# Altium schematic sheet PWM_inverter.SchDoc
size A4
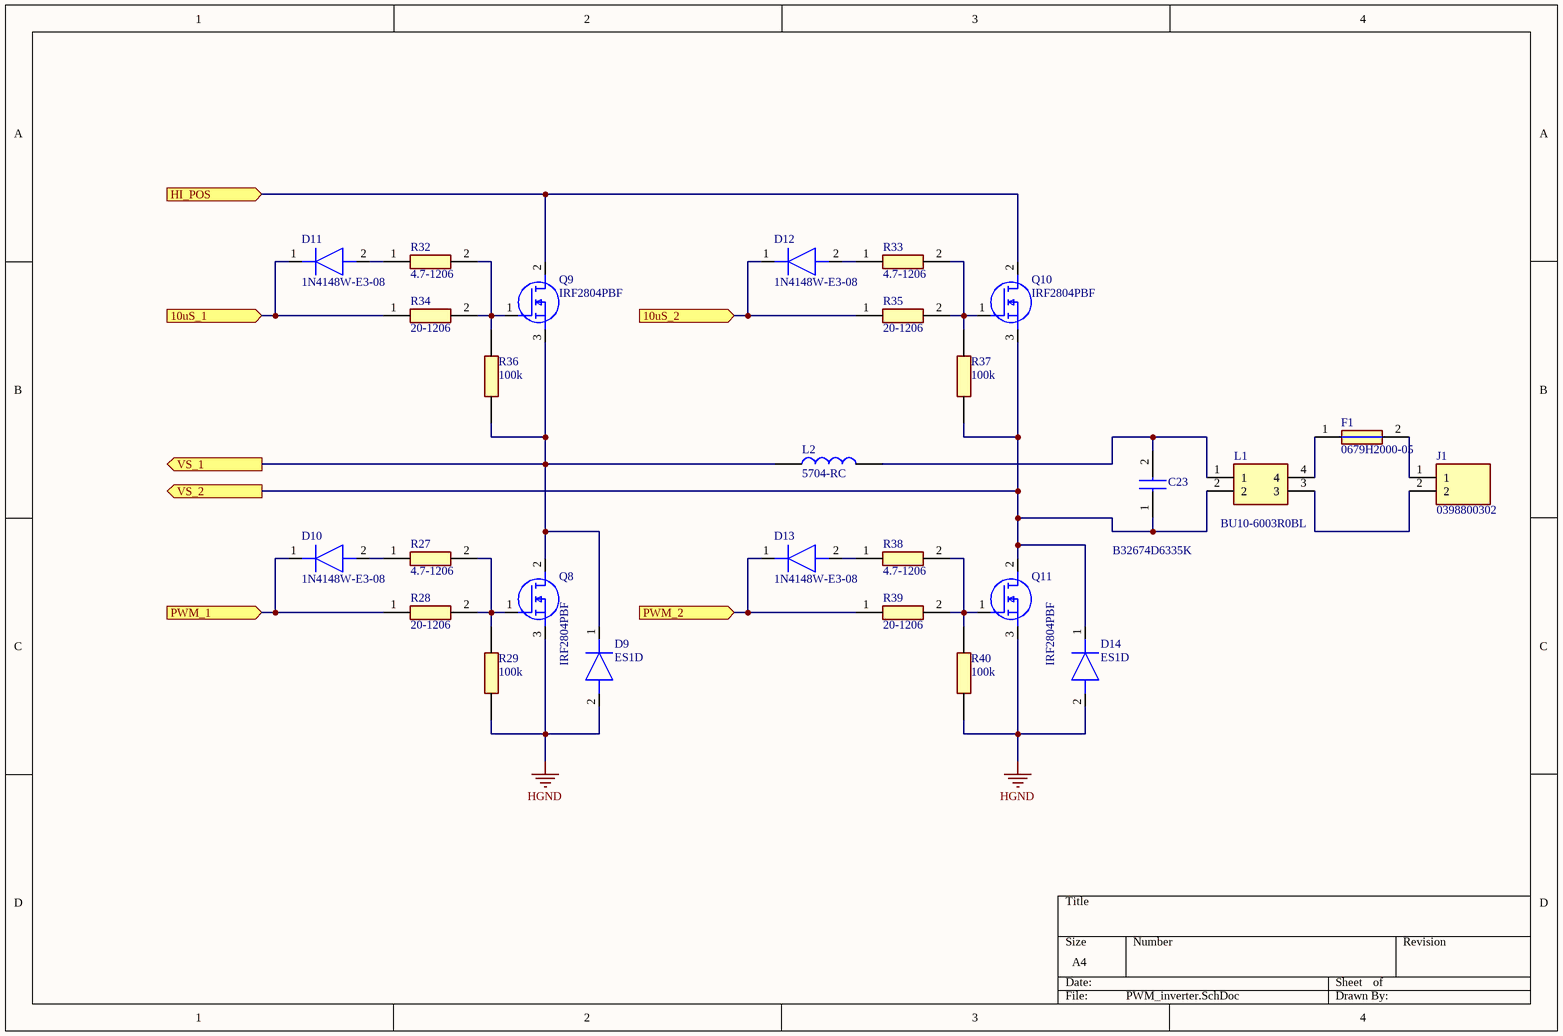
[diagram p0: PWM_inverter.SchDoc]

## Parts
C23  B32674D6335K  [B32674D6335K]
D9  ES1D  [DIOM5226X295N]
D10  1N4148W-E3-08  [SOD3716X135N]
D11  1N4148W-E3-08  [SOD3716X135N]
D12  1N4148W-E3-08  [SOD3716X135N]
D13  1N4148W-E3-08  [SOD3716X135N]
D14  ES1D  [DIOM5226X295N]
F1  0679H2000-05  [FUSC6125X279N]
J1  0398800302  [0398800302]
L1  BU10-6003R0BL  [BU106003R0BL]
L2  5704-RC  [5704RC]
Q8  IRF2804PBF  [TO254P482X1016X2192-3P]
Q9  IRF2804PBF  [TO254P482X1016X2192-3P]
Q10  IRF2804PBF  [TO254P482X1016X2192-3P]
Q11  IRF2804PBF  [TO254P482X1016X2192-3P]
R27  4.7-1206  [RESC3116X75N]
R28  20-1206  [RESC3116X75N]
R29  100k  [RESC2013X65N]
R32  4.7-1206  [RESC3116X75N]
R33  4.7-1206  [RESC3116X75N]
R34  20-1206  [RESC3116X75N]
R35  20-1206  [RESC3116X75N]
R36  100k  [RESC2013X65N]
R37  100k  [RESC2013X65N]
R38  4.7-1206  [RESC3116X75N]
R39  20-1206  [RESC3116X75N]
R40  100k  [RESC2013X65N]

## Ports
10uS_1 (in), 10uS_2 (in), HI_POS (in), PWM_1 (in), PWM_2 (in), VS_1 (out), VS_2 (out)

## Nets
HGND: D9.2(A) D14.2(A) Q8.3(S) Q11.3(S) R29.1 R40.1
10uS_1: D11.1(K) R34.1 ; port 10uS_1
10uS_2: D12.1(K) R35.1 ; port 10uS_2
HI_POS: Q9.2(D) Q10.2(D) ; port HI_POS
PWM_1: D10.1(K) R28.1 ; port PWM_1
PWM_2: D13.1(K) R39.1 ; port PWM_2
VS_1: D9.1(K) L2.1 Q8.2(D) Q9.3(S) R36.1 ; port VS_1
VS_2: C23.1 D14.1(K) L1.2 Q10.3(S) Q11.2(D) R37.1 ; port VS_2
NetC23_2: C23.2 L1.1 L2.2
NetD10_2: D10.2(A) R27.1
NetD11_2: D11.2(A) R32.1
NetD12_2: D12.2(A) R33.1
NetD13_2: D13.2(A) R38.1
NetF1_1: F1.1 L1.4
NetF1_2: F1.2 J1.1
NetJ1_2: J1.2 L1.3
NetQ8_1: Q8.1(G) R27.2 R28.2 R29.2
NetQ9_1: Q9.1(G) R32.2 R34.2 R36.2
NetQ10_1: Q10.1(G) R33.2 R35.2 R37.2
NetQ11_1: Q11.1(G) R38.2 R39.2 R40.2

## Library data of the parts
C23 = B32674D6335K: Capacitor; Manufacturer_Name: TDK; Datasheet Link: https://en.tdk.eu/inf/20/20/db/fc_2009/MKP_B32674_678.pdf; Height: 32mm; Manufacturer_Part_Number: B32674D6335K; Mouser Part Number: 871-B32674D6335K; Mouser Price/Stock: https://www.mouser.co.uk/ProductDetail/EPCOS-TDK/B32674D6335K?qs=IQR8xM2KsGjr5uKRT4Ngjw%3D%3D; Arrow Part Number: B32674D6335K; Arrow Price/Stock: https://www.arrow.com/en/products/b32674d6335k/epcos-tdk
D9 D14 = ES1D: Diode; Manufacturer_Name: SMC; Datasheet Link: https://4donline.ihs.com/images/VipMasterIC/IC/SMCD/SMCD-S-A0005425901/SMCD-S-A0005425901-1.pdf?hkey=833C7E3902CC3CD9C0453977398360A8; Height: 2.95mm; Manufacturer_Part_Number: ES1D
D10-D13 = 1N4148W-E3-08: Diode; Manufacturer_Name: Vishay; Datasheet Link: http://www.vishay.com/docs/85748/1n4148w.pdf; Height: 1.35mm; Manufacturer_Part_Number: 1N4148W-E3-08; Mouser Part Number: 78-1N4148W-E3-08; Mouser Price/Stock: https://www.mouser.co.uk/ProductDetail/Vishay-Semiconductors/1N4148W-E3-08?qs=bTzheeSci6TVjpxfjjRVMw%3D%3D; Arrow Part Number: 1N4148W-E3-08; Arrow Price/Stock: https://www.arrow.com/en/products/1n4148w-e3-08/vishay?region=nac
F1 = 0679H2000-05: Fuse; Manufacturer_Name: Bel Circuit Protection; Datasheet Link: https://www.arrow.com/en/products/0679h2000-05/bel-group; Height: 2.79mm; Manufacturer_Part_Number: 0679H2000-05; Arrow Part Number: 0679H2000-05; Arrow Price/Stock: https://www.arrow.com/en/products/0679h2000-05/bel-group?region=nac
J1 = 0398800302: Connector; Manufacturer_Name: Molex; Datasheet Link: https://www.molex.com/pdm_docs/sd/398800302_sd.pdf; Height: 10.3mm; Manufacturer_Part_Number: 0398800302; Mouser Part Number: N/A; Mouser Price/Stock: https://www.mouser.co.uk/ProductDetail/Molex/0398800302?qs=PBcRNPEHKsqSgs7Dx0mONg%3D%3D; Arrow Part Number: 0398800302; Arrow Price/Stock: https://www.arrow.com/en/products/0398800302/molex?region=nac
L1 = BU10-6003R0BL: Inductor; Manufacturer_Name: COILCRAFT; Datasheet Link: https://componentsearchengine.com/Datasheets/1/BU10-6003R0BL.pdf; Height: 22.5mm; Manufacturer_Part_Number: BU10-6003R0BL; Mouser Part Number: 994-BU10-6003R0BL; Mouser Price/Stock: https://www.mouser.co.uk/ProductDetail/Coilcraft/BU10-6003R0BL?qs=ZYnrCdKdyec0p%252B8vTszPQw%3D%3D
L2 = 5704-RC: Inductor High Current Toroid 275uH/150uH 15% 1KHz 2A 0.24Ohm DCR RDL; Manufacturer_Name: Bourns; Geometry.Height: 22.225mm; Manufacturer_Part_Number: 5704-RC; Mouser Part Number: 542-5704-RC; Mouser Price/Stock: https://www.mouser.co.uk/ProductDetail/JW-Miller/5704-RC?qs=bN78%2FnoHSDjVEliEAq9T7g%3D%3D; Arrow Part Number: *; Arrow Price/Stock: *; Mouser Testing Part Number: *; Mouser Testing Price/Stock: *; Datasheet Link: https://www.bourns.com/docs/Product-Datasheets/5700_series.pdf
Q8-Q11 = IRF2804PBF: MOSFET (N-Channel); Manufacturer_Name: Infineon; Datasheet Link: https://componentsearchengine.com/Datasheets/1/IRF2804PBF.pdf; Height: 4.82mm; Manufacturer_Part_Number: IRF2804PBF; Mouser Part Number: 942-IRF2804PBF; Mouser Price/Stock: https://www.mouser.co.uk/ProductDetail/Infineon-IR/IRF2804PBF?qs=2r01AXMCG3OqtrI77lWLsA%3D%3D; Arrow Part Number: IRF2804PBF; Arrow Price/Stock: https://www.arrow.com/en/products/irf2804pbf/infineon-technologies-ag
R27 R28 R32-R35 R38 R39 = MCMR12X1003FTL: Resistor; Height: 0.75mm
R29 R36 R37 R40 = ERJP06J822V: Resistor; Height: 0.7mm